# EAGLE design slice (EAGLE 6.4)
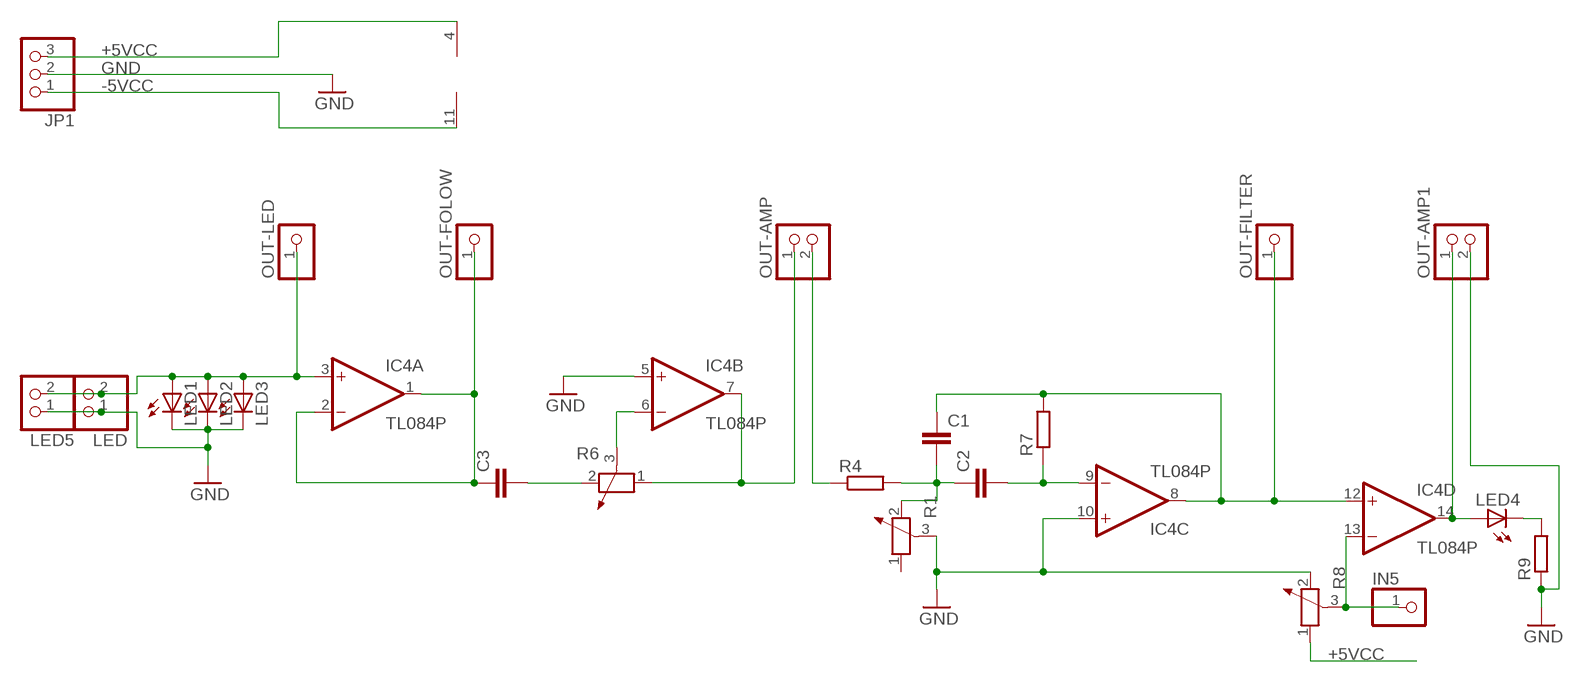
[diagram p0: schematic, sheet 1]

## Parts
C1  C-EU150-064X183  [C150-064X183]
C2  C-EU150-064X183  [C150-064X183]
C3  C-EU050-024X044  [C050-024X044]
IC4  TL084P  [DIL14]
IN5  PINHD-1X1  [1X01]
JP1  PINHD-1X3  [1X03]
LED  PINHD-1X2  [1X02]
LED1  LED5MM  [LED5MM]
LED2  LED5MM  [LED5MM]
LED3  LED5MM  [LED5MM]
LED4  LED5MM  [LED5MM]
LED5  PINHD-1X2  [1X02]
OUT-AMP  PINHD-1X2  [1X02]
OUT-AMP1  PINHD-1X2  [1X02]
OUT-FILTER  PINHD-1X1  [1X01]
OUT-FOLOW  PINHD-1X1  [1X01]
OUT-LED  PINHD-1X1  [1X01]
R1  POTENTIOMETER_PT-10  [PT-10]
R4  R-EU_0204/7  [0204/7]
R6  POTENTIOMETER_PT-10  [PT-10]
R7  R-EU_0204/7  [0204/7]
R8  POTENTIOMETER_PT-10  [PT-10]
R9  R-EU_0204/7  [0204/7]

## Nets
+5VCC: IC4.4(P:V+) JP1.3 R8.1
-5VCC: IC4.11(P:V-) JP1.1
GND: IC4.5(B:+IN) IC4.10(C:+IN) JP1.2 LED1.K(C) LED2.K(C) LED3.K(C) LED5.1 LED.1 OUT-AMP1.2 R1.3 R8.2 R9.1
N$1: OUT-AMP.2 R4.1
N$2: C3.2 R6.2
N$51: IC4.3(A:+IN) LED1.A LED2.A LED3.A LED5.2 LED.2 OUT-LED.1
N$172: C3.1 IC4.1(A:OUT) IC4.2(A:-IN) OUT-FOLOW.1
N$173: IC4.6(B:-IN) R6.3
N$174: IC4.7(B:OUT) OUT-AMP.1 R6.1
N$175: C1.2 C2.1 R1.2 R4.2
N$176: C1.1 IC4.8(C:OUT) IC4.12(D:+IN) OUT-FILTER.1 R7.2
N$177: C2.2 IC4.9(C:-IN) R7.1
N$179: IC4.13(D:-IN) IN5.1 R8.3
N$180: IC4.14(D:OUT) LED4.A OUT-AMP1.1
N$181: LED4.K(C) R9.2
Unconnected: R1.1

## Library data of the parts
C1-C3 = rcl:C-EU: CAPACITOR, European symbol
IC4 = linear:TL084: OP AMP
IN5 OUT-FILTER OUT-FOLOW OUT-LED = pinhead:PINHD-1X1: PIN HEADER
JP1 = pinhead:PINHD-1X3: PIN HEADER
LED LED5 OUT-AMP OUT-AMP1 = pinhead:PINHD-1X2: PIN HEADER
LED1-LED4 = led:LED: LED OSRAM: - CHIPLED LG R971, LG N971, LY N971, LG Q971, LY Q971, LO R971, LY R971 LH N974, LH R974 LS Q976, LO Q976, LY Q976 LO Q996 - Hyper CHIPLED LW Q18S LB Q993, LB Q99A, LB R99A - SideLED LS A670, LO A670, LY A670, LG A670, LP A670 LB A673, LV A673, LT A673, LW A673 LH A674 LY A675 LS A676, LA A676, LO A676, LY A676, LW A676 LS A679, LY A679, LG A679 - Hyper Micro SIDELED® LS Y876, LA Y876, LO Y876, LY Y876 LT Y87S - SmartLED LW L88C, LW L88S LB L89C, LB L89S, LG L890 LS L89K, LO L89K, LY L89K LS L896, LA L896, LO L896, LY L896 - TOPLED LS T670, LO T670, LY T670, LG T670, LP T670 LSG T670, LSP T670, LSY T670, LOP T670, LYG T670 LG T671, LOG T671, LSG T671 LB T673, LV T673, LT T673, LW T673 LH T674 LS T676, LA T676, LO T676, LY T676, LB T676, LH T676, LSB T676, LW T676 LB T67C, LV T67C, LT T67C, LS T67K, LO T67K, LY T67K, LW E67C LS E67B, LA E67B, LO E67B, LY E67B, LB E67C, LV E67C, LT E67C LW T67C LS T679, LY T679, LG T679 LS T770, LO T770, LY T770, LG T770, LP T770 LB T773, LV T773, LT T773, LW T773 LH T774 LS E675, LA E675, LY E675, LS T675 LS T776, LA T776, LO T776, LY T776, LB T776 LHGB T686 LT T68C, LB T68C - Hyper Mini TOPLED® LB M676 - Mini TOPLED Santana® LG M470 LS M47K, LO M47K, LY M47K Source: http://www.osram.convergy.de LUXEON: - LUMILED® LXK2-PW12-R00, LXK2-PW12-S00, LXK2-PW14-U00, LXK2-PW14-V00 LXK2-PM12-R00, LXK2-PM12-S00, LXK2-PM14-U00 LXK2-PE12-Q00, LXK2-PE12-R00, LXK2-PE12-S00, LXK2-PE14-T00, LXK2-PE14-U00 LXK2-PB12-K00, LXK2-PB12-L00, LXK2-PB12-M00, LXK2-PB14-N00, LXK2-PB14-P00, LXK2-PB14-Q00 LXK2-PR12-L00, LXK2-PR12-M00, LXK2-PR14-Q00, LXK2-PR14-R00 LXK2-PD12-Q00, LXK2-PD12-R00, LXK2-PD12-S00 LXK2-PH12-R00, LXK2-PH12-S00 LXK2-PL12-P00, LXK2-PL12-Q00, LXK2-PL12-R00 Source: www.luxeon.com KINGBRIGHT: KA-3528ASYC Source: www.kingbright.com
R1 R6 R8 = rcl:POTENTIOMETER_: Potentiometer
R4 R7 R9 = rcl:R-EU_: RESISTOR, European symbol

## Board
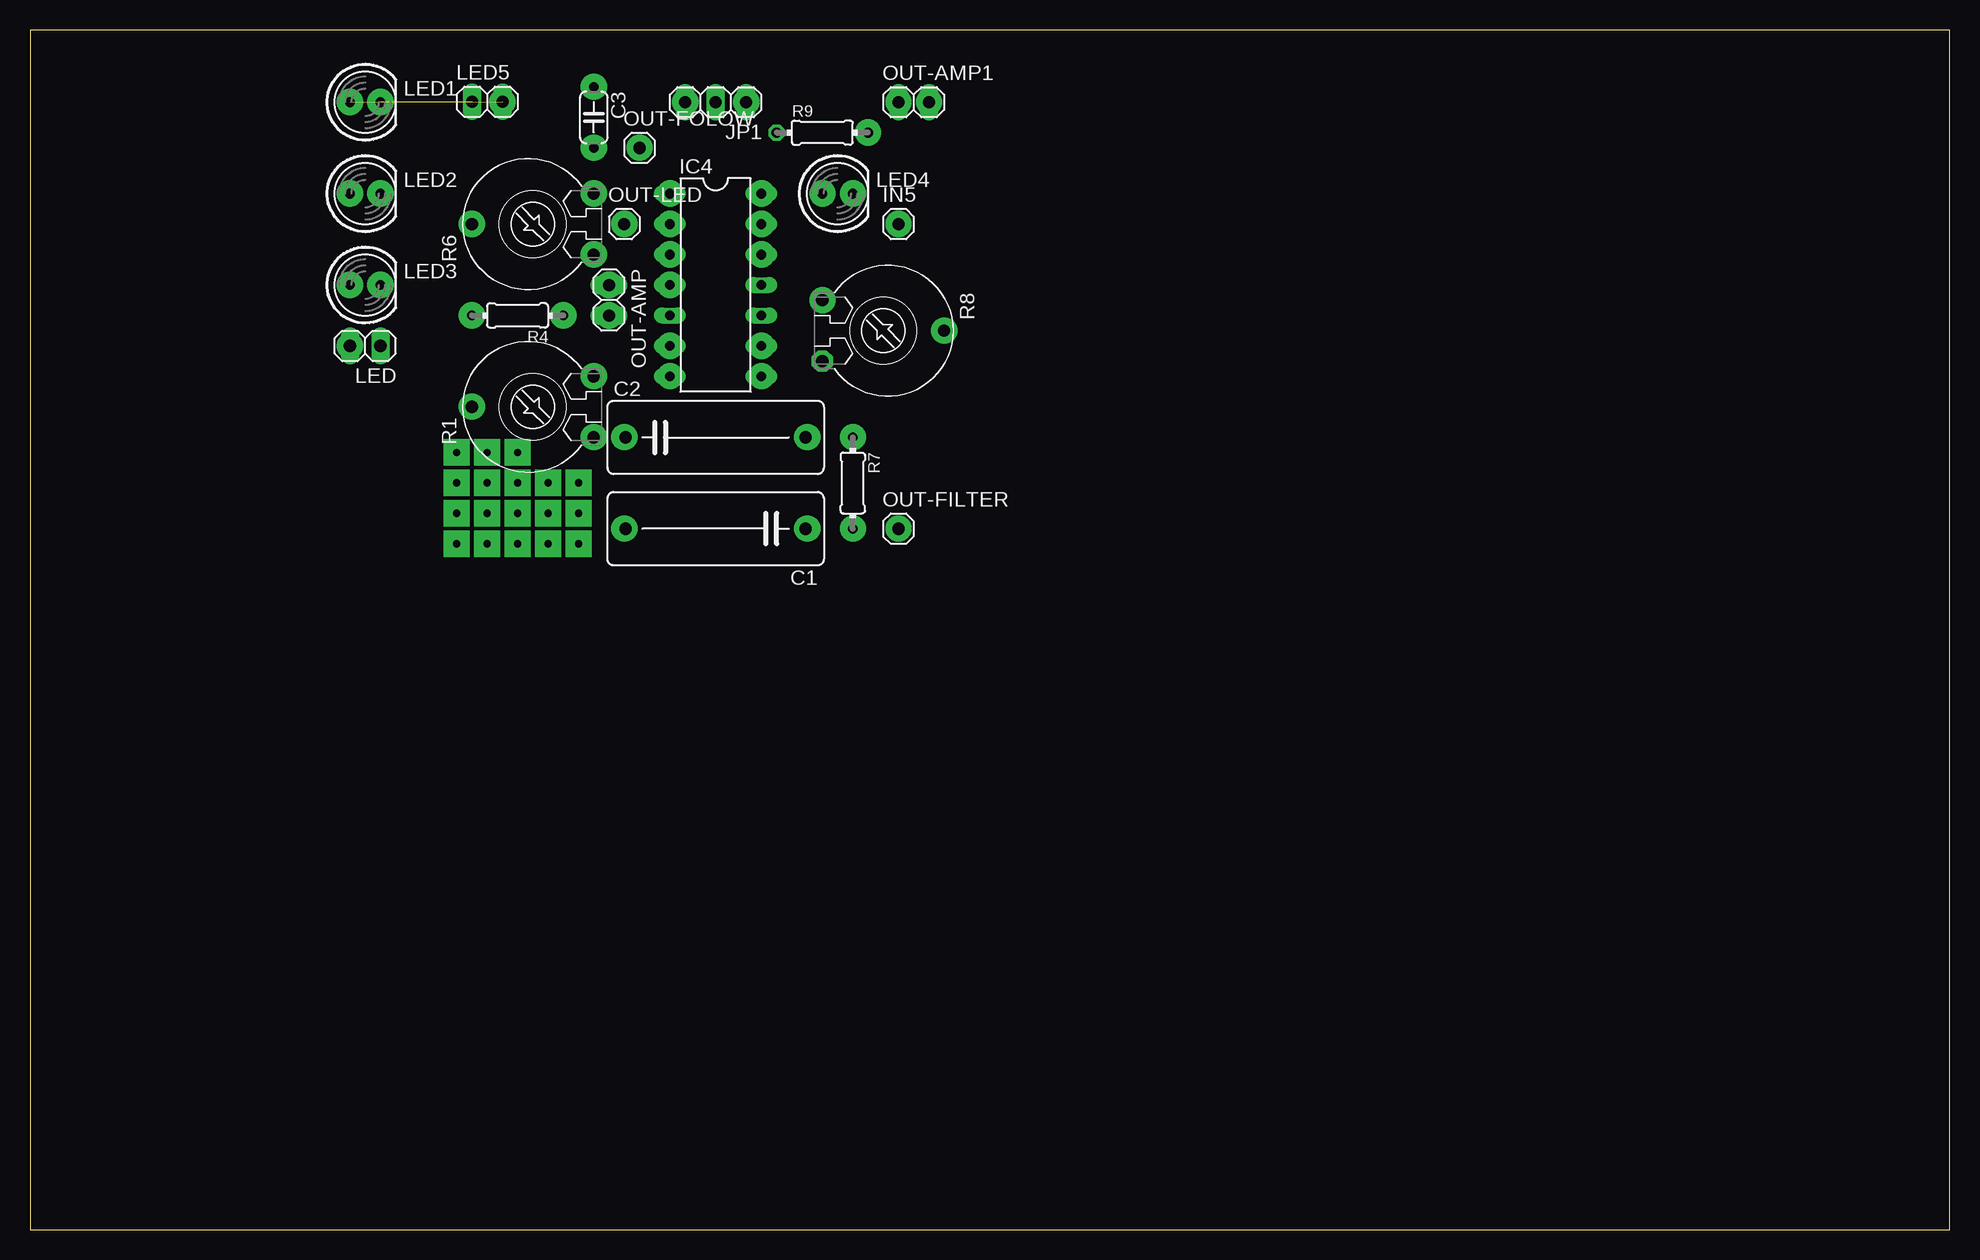
[diagram p1: board, top side]
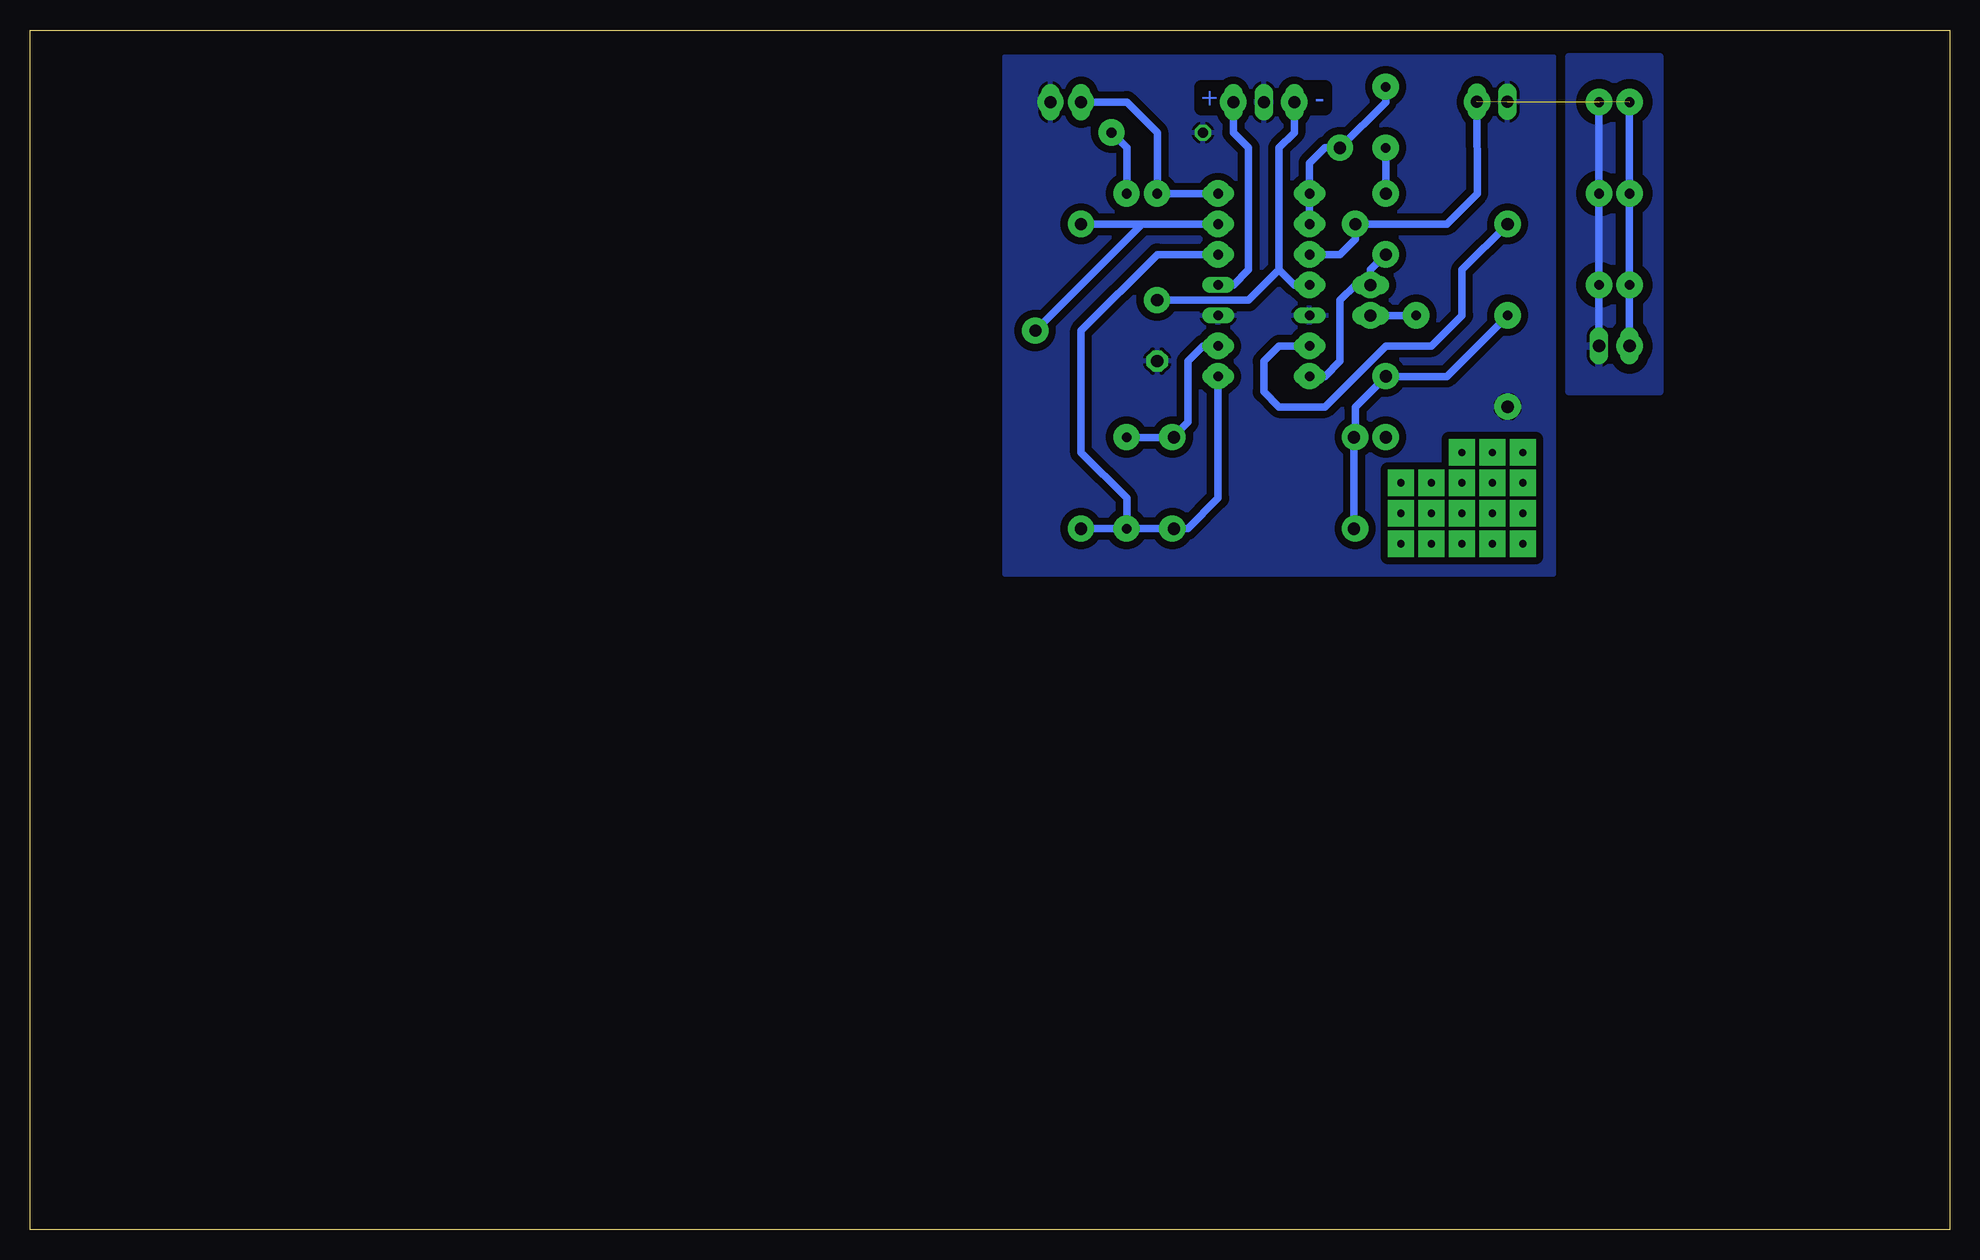
[diagram p2: board, bottom side, seen from below]

Size 160 x 100 mm. Coordinates in mm from the lower left corner, seen from the top.
Outline: 0,0 160,0 160,100 0,100 0,0
Copper layers (1*16): Top 0.035mm / dielectric 1.5mm / Bottom 0.035mm
Design rules "default": minimum track width 10mil, minimum drill 24mil, track to track 8mil, track to pad 8mil, pad to pad 8mil, via to via 8mil, smd to smd 8mil, copper to edge 40mil, drill to drill 8mil, minimum pad ring 10mil, minimum via ring 8mil, stop-mask expansion 4mil, vias tented up to drill 0mil, thermal gap 10mil

### Footprints (pad centres in the part's own frame; a part is rotated, then mirrored left to right if it is on the bottom)
C150-064X183 = drill 1.016 octagon: 1 -7.493,0; 2 7.493,0
C050-024X044 = drill 0.813 octagon: 1 -2.54,0; 2 2.54,0
DIL14 = drill 0.813 long: 1 -7.62,-3.81; 2 -5.08,-3.81; 3 -2.54,-3.81; 4 0,-3.81; 5 2.54,-3.81; 6 5.08,-3.81; 7 7.62,-3.81; 8 7.62,3.81; 9 5.08,3.81; 10 2.54,3.81; 11 0,3.81; 12 -2.54,3.81; 13 -5.08,3.81; 14 -7.62,3.81
1X01 = drill 1.016 octagon: 1 0,0
1X03 = drill 1.016 long: 1 -2.54,0; 2 0,0; 3 2.54,0
1X02 = drill 1.016 long: 1 -1.27,0; 2 1.27,0
LED5MM = drill 0.813 octagon: A -1.27,0; K 1.27,0
PT-10 = drill 1.016 pad 1.778 octagon: 1 -2.54,-5.08; 2 2.54,-5.08; 3 0,5.08
0204/7 = drill 0.813 octagon: 1 -3.81,0; 2 3.81,0

### Placement (x,y rotation side)
C1  57.15,58.42 180 top
C2  57.15,66.04 0 top
C3  46.99,92.71 270 top
IC4  57.15,78.74 270 top
IN5  72.39,83.82 0 top
JP1  57.15,93.98 180 top
LED  27.94,73.66 180 top
LED1  27.94,93.98 0 top
LED2  27.94,86.36 0 top
LED3  27.94,78.74 0 top
LED4  67.31,86.36 0 top
LED5  38.12,94.02 0 top
OUT-AMP  48.26,77.47 270 top
OUT-AMP1  73.66,93.98 0 top
OUT-FILTER  72.39,58.42 0 top
OUT-FOLOW  50.8,90.17 0 top
OUT-LED  49.53,83.82 0 top
R1  41.91,68.58 90 top
R4  40.64,76.2 180 top
R6  41.91,83.82 90 top
R7  68.58,62.23 270 top
R8  71.12,74.93 270 top
R9  66.04,91.44 0 top

### Tracks (layer width: path | path; a pad name or v marks a point on that pad's centre or on a via)
+5VCC
  Bottom 0.61: JP1.3 54.61,91.44 55.88,90.17 55.88,80.01 | 55.88,80.01 54.61,78.74 IC4.4 | R8.1 58.42,77.47 55.88,80.01
-5VCC
  Bottom 0.61: JP1.1 59.69,91.44 58.42,90.17 58.42,80.01 59.69,78.74 IC4.11
GND  (via drill 0.6 pad 2.18)  (1 unrouted)
  Bottom 0.61: LED1.K LED2.K LED3.K LED.1
  other vias: 36.84,68.59 74.94,94
  pour Bottom (isolate 0.61): 33.02,97.79 33.02,54.61 78.74,54.61 78.74,97.79
  pour Bottom (isolate 0.813): 24.13,97.79 24.13,69.85 31.75,69.85 31.75,97.79
N$1
  Bottom 0.61: OUT-AMP.2 R4.1
N$2
  Bottom 0.61: C3.2 R6.2
N$4  (via drill 0.6 pad 2.18)
  other vias: 47,66.05
N$5  (via drill 0.6 pad 2.18)
  other vias: 49.54,66.05
N$6  (via drill 0.6 pad 2.18)
  other vias: 47,71.13
N$7  (via drill 0.6 pad 2.18)
  other vias: 36.84,76.22
N$8  (via drill 0.6 pad 2.18)
  other vias: 44.46,76.22
N$9  (via drill 0.6 pad 2.18)
  other vias: 36.84,83.84
N$10  (via drill 0.6 pad 2.18)
  other vias: 47,81.3
N$11  (via drill 0.6 pad 2.18)
  other vias: 48.27,78.76
N$12  (via drill 0.6 pad 2.18)
  other vias: 48.27,76.22
N$13  (via drill 0.6 pad 2.18)
  other vias: 49.54,83.84
N$14  (via drill 0.6 pad 2.18)
  other vias: 47,86.38
N$15  (via drill 0.6 pad 2.18)
  other vias: 47,90.19
N$16  (via drill 0.6 pad 2.18)
  other vias: 47,95.27
N$17  (via drill 0.6 pad 2.18)
  other vias: 39.38,94
N$20  (via drill 0.6 pad 2.18)
  other vias: 69.86,91.46
N$21  (via drill 0.6 pad 2.18)
  other vias: 66.05,86.38
N$22  (via drill 0.6 pad 2.18)
  other vias: 68.59,86.38
N$23  (via drill 0.6 pad 2.18)
  other vias: 72.4,83.84
N$24  (via drill 0.6 pad 2.18)
  other vias: 76.22,74.94
N$25  (via drill 0.6 pad 2.18)
  other vias: 66.05,77.49
N$27  (via drill 0.6 pad 2.18)
  other vias: 64.78,66.05
N$28  (via drill 0.6 pad 2.18)
  other vias: 68.59,66.05
N$29  (via drill 0.6 pad 2.18)
  other vias: 68.59,58.43
N$30  (via drill 0.6 pad 2.18)
  other vias: 72.4,58.43
N$31  (via drill 0.6 pad 2.18)
  other vias: 64.78,58.43
N$32  (via drill 0.6 pad 2.18)
  other vias: 49.54,58.43
N$33  (via drill 0.6 pad 2.18)
  other vias: 50.81,90.19
N$34  (via drill 0.6 pad 2.18)
  other vias: 54.62,94
N$36  (via drill 0.6 pad 2.18)
  other vias: 59.7,94
N$37  (via drill 0.6 pad 2.18)
  other vias: 29.22,94
N$38  (via drill 0.6 pad 2.18)
  other vias: 26.68,94
N$39  (via drill 0.6 pad 2.18)
  other vias: 26.68,86.38
N$40  (via drill 0.6 pad 2.18)
  other vias: 29.22,86.38
N$41  (via drill 0.6 pad 2.18)
  other vias: 29.22,78.76
N$42  (via drill 0.6 pad 2.18)
  other vias: 26.68,78.76
N$43  (via drill 0.6 pad 2.18)
  other vias: 26.68,73.67
N$45  (via drill 0.6 pad 2.18)
  other vias: 53.35,86.38
N$46  (via drill 0.6 pad 2.18)
  other vias: 53.35,83.84
N$47  (via drill 0.6 pad 2.18)
  other vias: 53.35,81.3
N$48  (via drill 0.6 pad 2.18)
  other vias: 53.35,78.76
N$50  (via drill 0.6 pad 2.18)
  other vias: 53.35,73.67
N$51  (1 unrouted)
  Bottom 0.61: LED1.A LED2.A LED3.A LED.2 | IC4.3 50.8,81.28 49.53,82.55 OUT-LED.1 41.91,83.82 39.37,86.36 LED5.2
N$52  (via drill 0.6 pad 2.18)
  other vias: 53.35,71.13
N$53  (via drill 0.6 pad 2.18)
  other vias: 60.97,71.13
N$54  (via drill 0.6 pad 2.18)
  other vias: 60.97,73.67
N$55  (via drill 0.6 pad 2.18)
  other vias: 60.97,81.3
N$56  (via drill 0.6 pad 2.18)
  other vias: 60.97,83.84
N$57  (via drill 0.6 pad 2.18)
  other vias: 60.97,86.38
N$58  (via drill 0.6 pad 2.18)
  other vias: 72.4,94
N$60  (via drill 0.6 pad 2.18)
  other vias: 35.57,62.24
N$61  (via drill 0.6 pad 2.18)
  other vias: 38.11,62.24
N$62  (via drill 0.6 pad 2.18)
  other vias: 40.65,62.24
N$63  (via drill 0.6 pad 2.18)
  other vias: 43.19,62.24
N$64  (via drill 0.6 pad 2.18)
  other vias: 45.73,62.24
N$65  (via drill 0.6 pad 2.18)
  other vias: 45.73,59.7
N$66  (via drill 0.6 pad 2.18)
  other vias: 43.19,59.7
N$67  (via drill 0.6 pad 2.18)
  other vias: 40.65,59.7
N$68  (via drill 0.6 pad 2.18)
  other vias: 38.11,59.7
N$69  (via drill 0.6 pad 2.18)
  other vias: 35.57,59.7
N$70  (via drill 0.6 pad 2.18)
  other vias: 35.57,57.16
N$71  (via drill 0.6 pad 2.18)
  other vias: 38.11,57.16
N$72  (via drill 0.6 pad 2.18)
  other vias: 40.65,57.16
N$73  (via drill 0.6 pad 2.18)
  other vias: 43.19,57.16
N$74  (via drill 0.6 pad 2.18)
  other vias: 45.73,57.16
N$75  (via drill 0.6 pad 2.18)
  other vias: 35.57,64.78
N$76  (via drill 0.6 pad 2.18)
  other vias: 38.11,64.78
N$77  (via drill 0.6 pad 2.18)
  other vias: 40.65,64.78
N$172
  Bottom 0.61: IC4.2 IC4.1 53.34,88.9 52.08,90.19 OUT-FOLOW.1 46.99,93.98 C3.1
N$173
  Bottom 0.61: IC4.6 55.88,73.66 57.15,72.39 57.15,69.85 55.88,68.58 52.07,68.58 46.99,73.66 43.18,73.66 40.64,76.2 40.64,80.01 R6.3
N$174
  Bottom 0.61: IC4.7 52.07,71.12 50.8,72.39 50.8,77.47 49.53,78.74 OUT-AMP.1 48.26,80.01 R6.1
N$175
  Bottom 0.61: R4.2 41.91,71.12 R1.2 49.53,68.58 49.53,66.17 C2.1 C1.2
N$176
  Bottom 0.61: IC4.8 60.96,60.96 63.5,58.42 C1.1 R7.2 | R7.2 68.58,60.96 72.39,64.77 72.39,74.93 66.04,81.28 IC4.12 | OUT-FILTER.1 R7.2
N$177
  Bottom 0.61: R7.1 C2.2 64.64,66.17 63.5,67.31 63.5,72.39 62.23,73.66 IC4.9
N$179
  Bottom 0.61: R8.3 67.31,83.82 | 67.31,83.82 IC4.13 | IN5.1 67.31,83.82
N$180
  Bottom 0.61: IC4.14 LED4.A 66.04,91.44 68.58,93.98 OUT-AMP1.1
N$181
  Bottom 0.61: R9.2 68.58,90.17 LED4.K

### Text on the board
Bottom: - | +